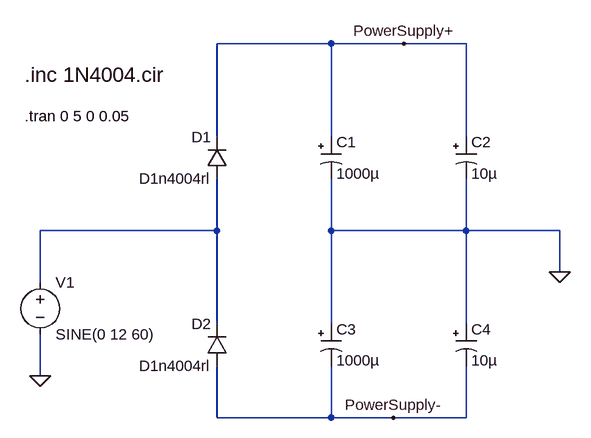
[diagram p0: schematic rectifier.asc]
rectifier.asc, the LTspice schematic file:
Version 4
SHEET 1 880 680
WIRE -288 -480 -464 -480
WIRE -176 -480 -288 -480
WIRE -80 -480 -176 -480
WIRE -464 -336 -464 -480
WIRE -288 -336 -288 -480
WIRE -80 -336 -80 -480
WIRE -464 -192 -464 -272
WIRE -464 -192 -736 -192
WIRE -288 -192 -288 -272
WIRE -80 -192 -80 -272
WIRE -80 -192 -288 -192
WIRE 64 -192 -80 -192
WIRE 64 -128 64 -192
WIRE -736 -112 -736 -192
WIRE -464 -48 -464 -192
WIRE -288 -48 -288 -192
WIRE -80 -48 -80 -192
WIRE -736 32 -736 -32
WIRE -464 96 -464 16
WIRE -288 96 -288 16
WIRE -288 96 -464 96
WIRE -192 96 -288 96
WIRE -80 96 -80 16
WIRE -80 96 -192 96
FLAG -736 32 0
FLAG 64 -128 0
FLAG -176 -480 PowerSupply+
FLAG -192 96 PowerSupply-
SYMBOL polcap -304 -336 R0
WINDOW 3 24 56 Left 2
SYMATTR Value 1000µ
SYMATTR InstName C1
SYMATTR Description Capacitor
SYMATTR Type cap
SYMATTR SpiceLine V=100 Irms=1.33 Rser=0.047 Lser=0 mfg="Nichicon" pn="UPR2A102MRH" type="Al electrolytic"
SYMBOL voltage -736 -128 R0
WINDOW 123 0 0 Left 2
WINDOW 39 0 0 Left 2
SYMATTR InstName V1
SYMATTR Value SINE(0 12 60)
SYMBOL polcap -96 -336 R0
SYMATTR InstName C2
SYMATTR Value 10µ
SYMBOL diode -448 -272 R180
WINDOW 0 24 64 Left 2
WINDOW 3 24 0 Left 2
SYMATTR InstName D1
SYMATTR Value D1n4004rl
SYMBOL diode -448 16 R180
WINDOW 0 24 64 Left 2
WINDOW 3 24 0 Left 2
SYMATTR InstName D2
SYMATTR Value D1n4004rl
SYMBOL polcap -304 -48 R0
WINDOW 3 24 56 Left 2
SYMATTR Value 1000µ
SYMATTR InstName C3
SYMATTR Description Capacitor
SYMATTR Type cap
SYMATTR SpiceLine V=100 Irms=1.33 Rser=0.047 Lser=0 mfg="Nichicon" pn="UPR2A102MRH" type="Al electrolytic"
SYMBOL polcap -96 -48 R0
SYMATTR InstName C4
SYMATTR Value 10µ
TEXT -760 -432 Left 3 !.inc 1N4004.cir
TEXT -760 -368 Left 2 !.tran 0 5 0 0.05

The netlist it stands for:
* rectifier.asc
C1 PowerSupply+ 0 1000µ V=100 Irms=1.33 Rser=0.047 Lser=0 mfg="Nichicon" pn="UPR2A102MRH" type="Al electrolytic"
V1 N001 0 SINE(0 12 60)
C2 PowerSupply+ 0 10µ
D1 N001 PowerSupply+ D1n4004rl
D2 PowerSupply- N001 D1n4004rl
C3 0 PowerSupply- 1000µ V=100 Irms=1.33 Rser=0.047 Lser=0 mfg="Nichicon" pn="UPR2A102MRH" type="Al electrolytic"
C4 0 PowerSupply- 10µ
.model D D
.lib standard.dio
.inc 1N4004.cir
.tran 0 5 0 0.05
.backanno
.end